# Altium schematic sheet Experiment 5 0.0.0.SchDoc
size A4; Organization: Altium Limited; Address1: L3, 12a Rodborough Rd; Address2: Frenchs Forest; Address3: NSW; Address4: Australia 2086; DocumentNumber: 5; SheetNumber: 5; SheetTotal: 5
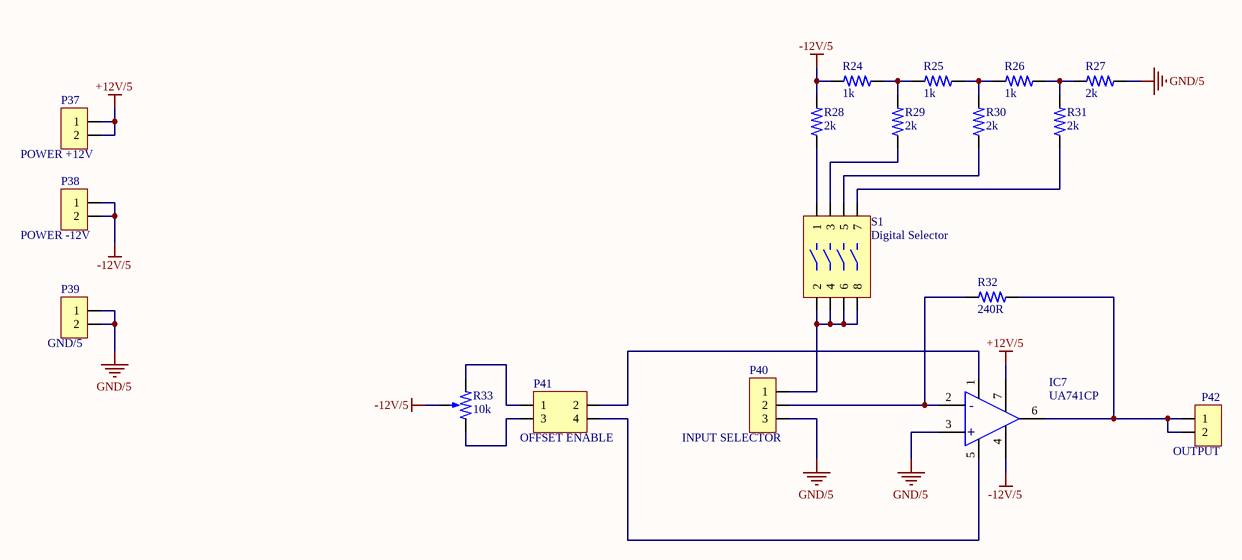
[diagram p0: Experiment 5 0.0.0.SchDoc]

## Parts
IC7  UA741CP  [DIP-8]
P37  POWER +12V  [PINHD-1X02 ONCE]
P38  POWER -12V  [PINHD-1X02 ONCE]
P39  GND/5  [PINHD-1X02 ONCE]
P40  INPUT SELECTOR  [PINHD-1X03]
P41  OFFSET ENABLE  [PINHD-2X02]
P42  OUTPUT  [PINHD-1X02 ONCE]
R24  1k  [R Axial 0.25]
R25  1k  [R Axial 0.25]
R26  1k  [R Axial 0.25]
R27  2k  [R Axial 0.25]
R28  2k  [R Axial 0.25]
R29  2k  [R Axial 0.25]
R30  2k  [R Axial 0.25]
R31  2k  [R Axial 0.25]
R32  240R  [R Axial 0.25]
R33  10k  [PV36W]
S1  Digital Selector  [DIP-206-4S]

## Nets
+12V/5: IC7.7(VCC+) P37.1 P37.2
-12V/5: IC7.4(VCC-) P38.1 P38.2 R24.1 R28.2 R33.2
GND/5: IC7.3(+) P39.1 P39.2 P40.3 R27.2
NetIC7_1: IC7.1(OFFSET1) P41.2
NetIC7_2: IC7.2(-) P40.2 R32.1
NetIC7_5: IC7.5(OFFSET2) P41.4
NetIC7_6: IC7.6(OUTPUT) P42.1 P42.2 R32.2
NetP40_1: P40.1 S1.2 S1.4 S1.6 S1.8
NetP41_1: P41.1 R33.1
NetP41_3: P41.3 R33.3
NetR24_2: R24.2 R25.1 R29.2
NetR25_2: R25.2 R26.1 R30.2
NetR26_2: R26.2 R27.1 R31.2
NetR28_1: R28.1 S1.1
NetR29_1: R29.1 S1.3
NetR30_1: R30.1 S1.5
NetR31_1: R31.1 S1.7

## Notes on the sheet
- Elivelton Santos
- https://github.com/eliveltonpsantos
- Project:
- Sheet:
- Date:
- Time:
- Sheet
- of
- File:

## Library data of the parts
IC7 = UA741CP: IC OPAMP GP 1MHZ 8DIP; Manufacturer: Texas Instruments; Category: ICs; Manufacturer Part Number: UA741CP; Package / Case: 8-PDIP; Supplier 1: Digi-Key; Supplier Part Number 1: 296-11107-5-ND
P37-P39 P42 = PIN HEADER 1X02 ONCE: CONN HEADER 2POS .100" STR TIN; Manufacturer: Molex, LLC; Manufacturer Part Number: 0901200122; Category: Connectors; Supplier 1: Digi-Key; Supplier Part Number 1: WM8072-ND
P40 = PIN HEADER 1X03: CONN HEADER 3POS .100" STR TIN; Manufacturer: Molex, LLC; Manufacturer Part Number: 0901200123; Category: Connectors; Supplier 1: Digi-Key; Supplier Part Number 1: WM8073-ND
P41 = PIN HEADER 2X02: CONN HEADER 4POS .100" STR TIN; Manufacturer: Molex, LLC; Manufacturer Part Number: 0901310122; Category: Connectors; Supplier 1: Digi-Key; Supplier Part Number 1: WM8120-ND
R24-R26 = CFR-25JB-52-1K: RES 1K OHM 1/4W 5% AXIAL; Manufacturer: Yageo; Power (Watts): 0.25W, 1/4W; Category: Resistors; Manufacturer Part Number: CFR-25JB-52-1K; Package / Case: Axial; Resistance (Ohms): 1k; Tolerance: ±5%; Supplier 1: Digi-Key; Supplier Part Number 1: 1.0KQBK-ND
R27-R31 = CFR-25JB-52-2K: RES 2K OHM 1/4W 5% AXIAL; Manufacturer: Yageo; Power (Watts): 0.25W, 1/4W; Category: Resistors; Manufacturer Part Number: CFR-25JB-52-2K; Package / Case: Axial; Resistance (Ohms): 2k; Tolerance: ±5%; Supplier 1: Digi-Key; Supplier Part Number 1: 2.0KQBK-ND
R32 = CFR-25JB-52-240R: RES 240 OHM 1/4W 5% AXIAL; Manufacturer: Yageo; Power (Watts): 0.25W, 1/4W; Resistance (Ohms): 250; Category: Resistors; Manufacturer Part Number: CFR-25JB-52-240R; Package / Case: Axial; Tolerance: ±5%; Supplier 1: Digi-Key; Supplier Part Number 1: 240QBK-ND
R33 = PV36W103C01B00: TRIMMER 10K OHM 0.5W TH; Manufacturer: Bourns Inc.; Power (Watts): 0.5W, 1/2W; Tolerance: ±10%; Number of Turns: 25; Adjustment Type: Top Adjustment; Category: Resistors; Manufacturer Part Number: PV36W103C01B00; Resistance (Ohms): 10k; Supplier 1: Digi-Key; Supplier Part Number 1: 490-2875-ND
S1 = 206-4: SWITCH SLIDE DIP SPST 50MA 24V; Manufacturer: CTS Electrocomponents; Pitch: 0.100" (2.54mm); Number of Positions: 4; Category: Switches; Manufacturer Part Number: 206-4; Supplier 1: Digi-Key; Supplier Part Number 1: CT2064-ND